# Altium schematic sheet СОЕД.SchDoc
size A2; Organization: Altium Limited; Address1: L3, 12a Rodborough Rd; Address2: Frenchs Forest; Address3: NSW; Address4: Australia 2086; SheetNumber: 1; SheetTotal: 5
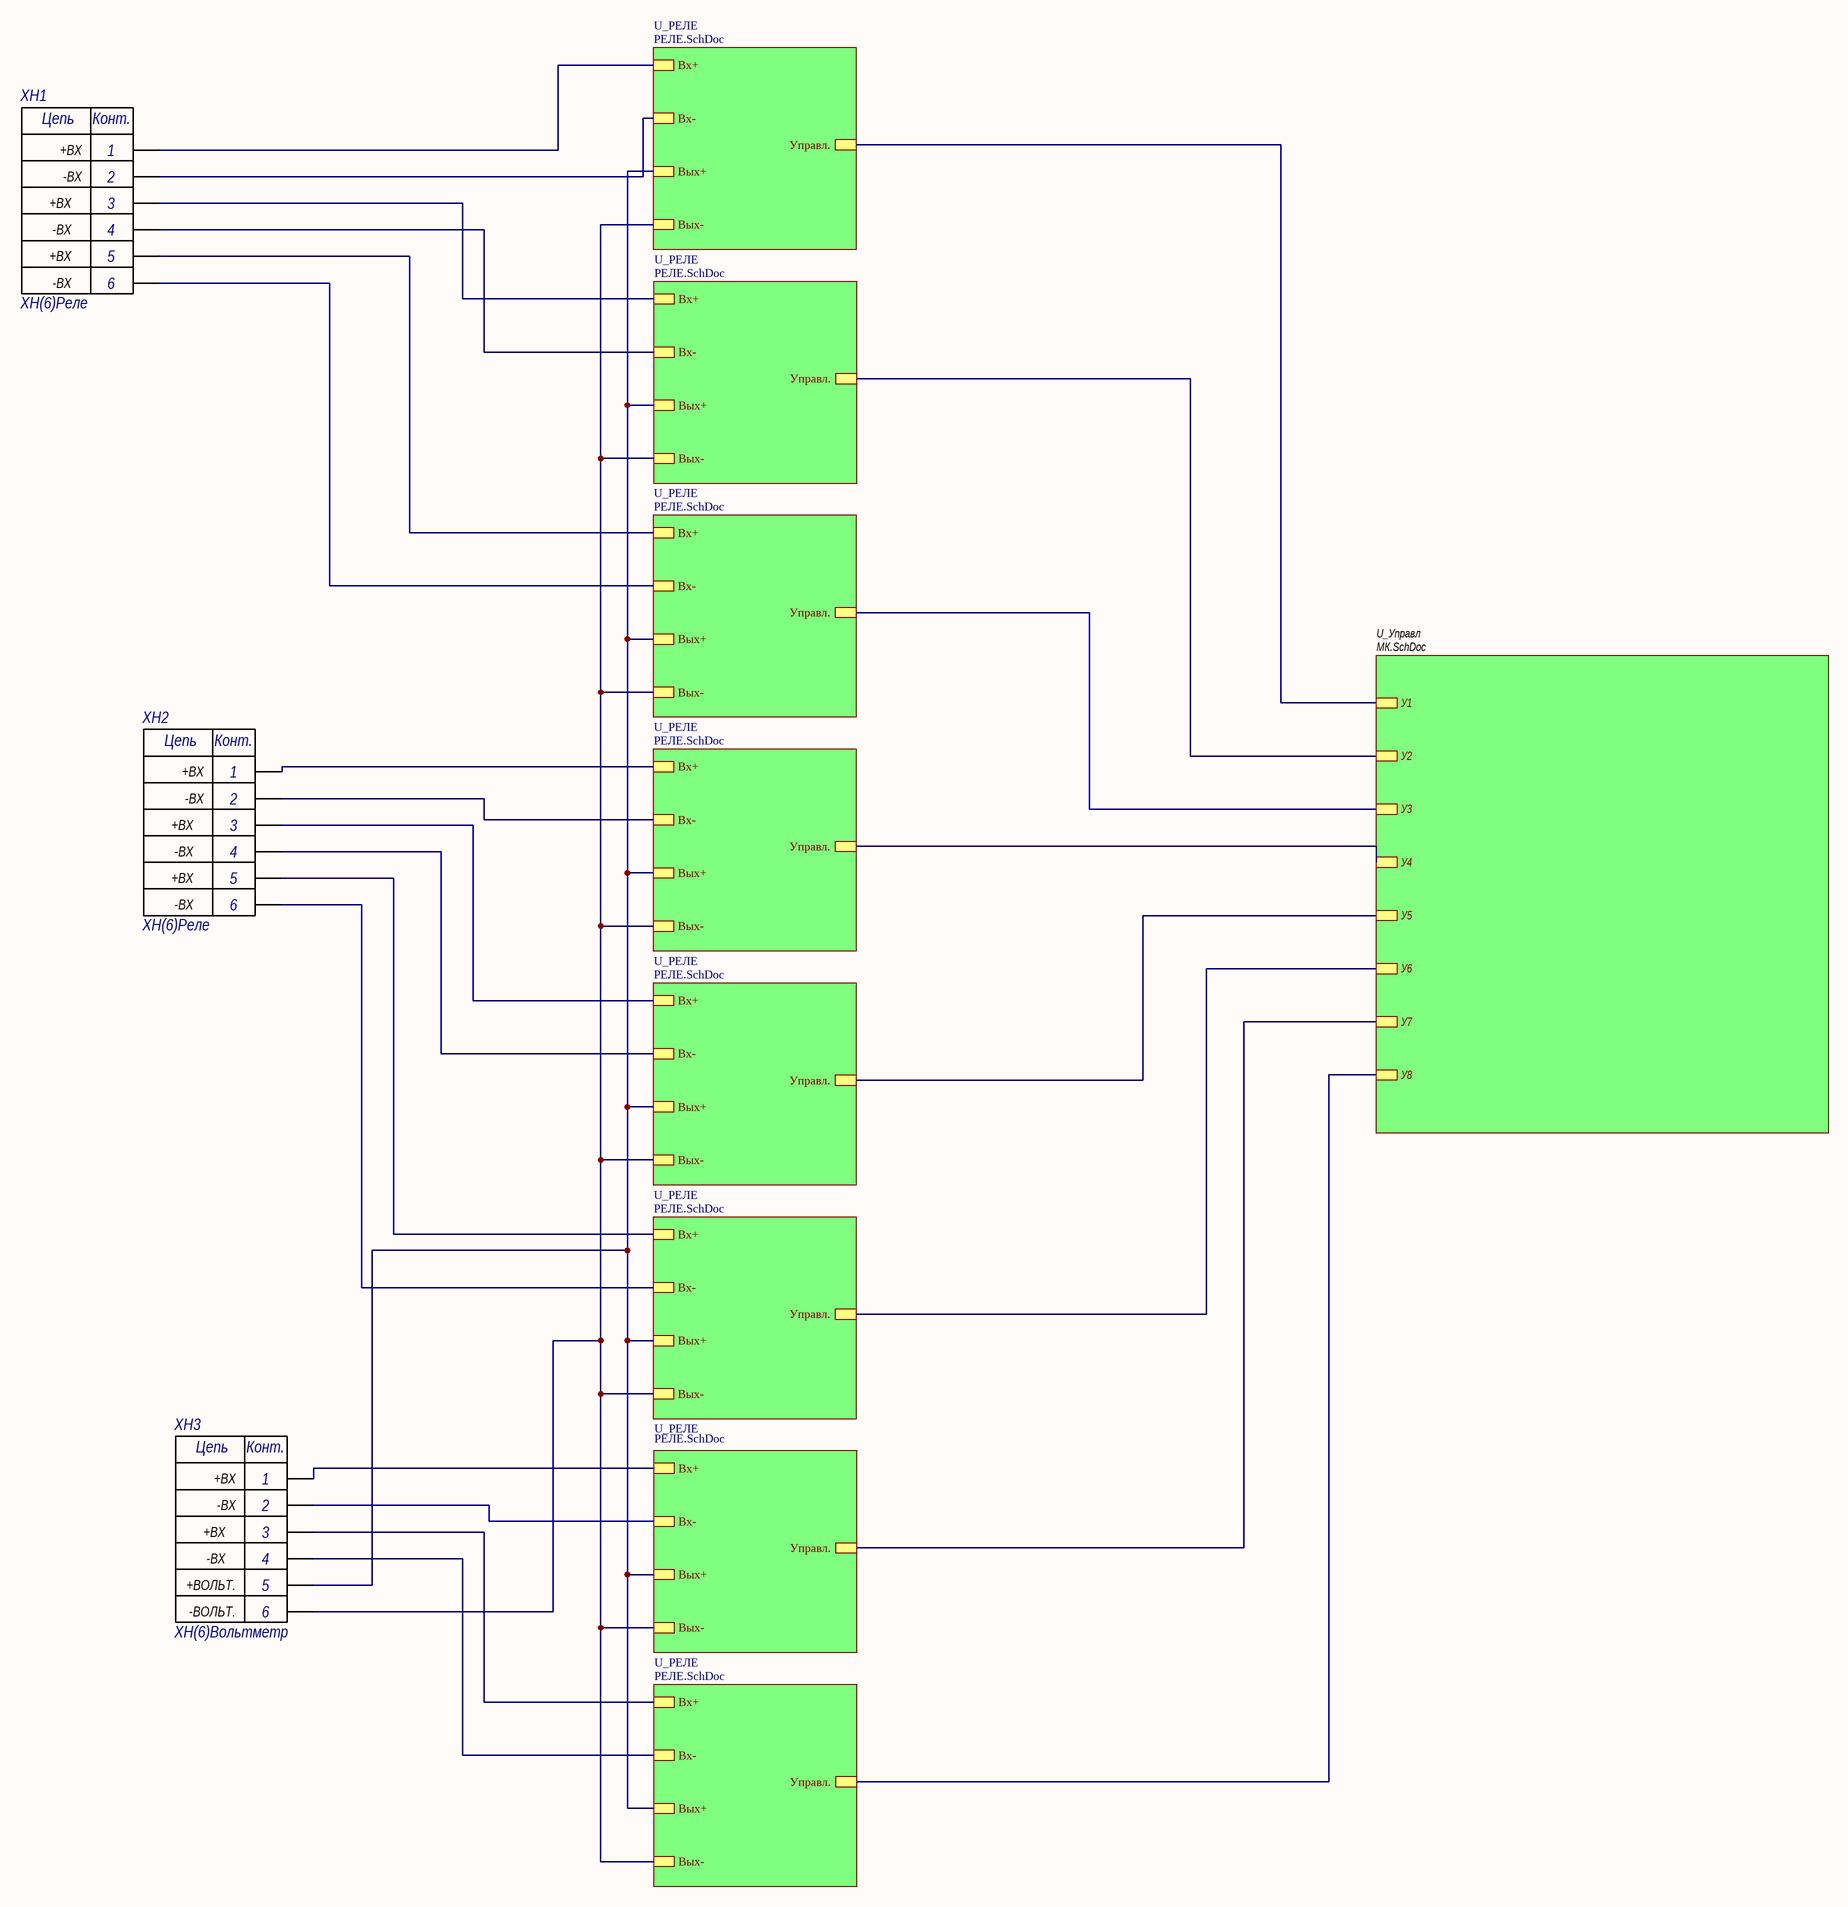
[diagram p0: СОЕД.SchDoc]

## Parts
XH1  ХH(6)Реле  [XH(6)]
XH2  ХH(6)Реле  [XH(6)]
XH3  ХH(6)Вольтметр  [XH(6)]

## Sub-sheets
U_РЕЛЕ = РЕЛЕ.SchDoc: Управл., Вх+, Вх-, Вых-, Вых+
U_РЕЛЕ = РЕЛЕ.SchDoc: Управл., Вх+, Вх-, Вых-, Вых+
U_РЕЛЕ = РЕЛЕ.SchDoc: Управл., Вх+, Вх-, Вых-, Вых+
U_РЕЛЕ = РЕЛЕ.SchDoc: Управл., Вх+, Вх-, Вых-, Вых+
U_РЕЛЕ = РЕЛЕ.SchDoc: Управл., Вх+, Вх-, Вых-, Вых+
U_РЕЛЕ = РЕЛЕ.SchDoc: Управл., Вх+, Вх-, Вых-, Вых+
U_РЕЛЕ = РЕЛЕ.SchDoc: Управл., Вх+, Вх-, Вых-, Вых+
U_РЕЛЕ = РЕЛЕ.SchDoc: Управл., Вх+, Вх-, Вых-, Вых+
U_Управл = МК.SchDoc: У8, У7, У2, У6, У5, У3, У1, У4

## Nets
NetXH1_1: XH1.1(+ВХ) ; sheet U_РЕЛЕ/Вх+
NetXH1_2: XH1.2(-ВХ) ; sheet U_РЕЛЕ/Вх-
NetXH1_3: XH1.3(+ВХ) ; sheet U_РЕЛЕ/Вх+
NetXH1_4: XH1.4(-ВХ) ; sheet U_РЕЛЕ/Вх-
NetXH1_5: XH1.5(+ВХ) ; sheet U_РЕЛЕ/Вх+
NetXH1_6: XH1.6(-ВХ) ; sheet U_РЕЛЕ/Вх-
NetXH2_1: XH2.1(+ВХ) ; sheet U_РЕЛЕ/Вх+
NetXH2_2: XH2.2(-ВХ) ; sheet U_РЕЛЕ/Вх-
NetXH2_3: XH2.3(+ВХ) ; sheet U_РЕЛЕ/Вх+
NetXH2_4: XH2.4(-ВХ) ; sheet U_РЕЛЕ/Вх-
NetXH2_5: XH2.5(+ВХ) ; sheet U_РЕЛЕ/Вх+
NetXH2_6: XH2.6(-ВХ) ; sheet U_РЕЛЕ/Вх-
NetXH3_1: XH3.1(+ВХ) ; sheet U_РЕЛЕ/Вх+
NetXH3_2: XH3.2(-ВХ) ; sheet U_РЕЛЕ/Вх-
NetXH3_3: XH3.3(+ВХ) ; sheet U_РЕЛЕ/Вх+
NetXH3_4: XH3.4(-ВХ) ; sheet U_РЕЛЕ/Вх-
NetXH3_5: XH3.5(+ВОЛЬТ.) ; sheet U_РЕЛЕ/Вых+, sheet U_РЕЛЕ/Вых+, sheet U_РЕЛЕ/Вых+, sheet U_РЕЛЕ/Вых+, sheet U_РЕЛЕ/Вых+, sheet U_РЕЛЕ/Вых+, sheet U_РЕЛЕ/Вых+, sheet U_РЕЛЕ/Вых+
NetXH3_6: XH3.6(-ВОЛЬТ.) ; sheet U_РЕЛЕ/Вых-, sheet U_РЕЛЕ/Вых-, sheet U_РЕЛЕ/Вых-, sheet U_РЕЛЕ/Вых-, sheet U_РЕЛЕ/Вых-, sheet U_РЕЛЕ/Вых-, sheet U_РЕЛЕ/Вых-, sheet U_РЕЛЕ/Вых-
(unnamed): sheet U_РЕЛЕ/Управл., sheet U_Управл/У1
(unnamed): sheet U_Управл/У8, sheet U_РЕЛЕ/Управл.
(unnamed): sheet U_Управл/У7, sheet U_РЕЛЕ/Управл.
(unnamed): sheet U_Управл/У2, sheet U_РЕЛЕ/Управл.
(unnamed): sheet U_Управл/У6, sheet U_РЕЛЕ/Управл.
(unnamed): sheet U_Управл/У5, sheet U_РЕЛЕ/Управл.
(unnamed): sheet U_Управл/У3, sheet U_РЕЛЕ/Управл.
(unnamed): sheet U_Управл/У4, sheet U_РЕЛЕ/Управл.

## Notes on the sheet
- Title
- Size:
- Date:
- File:
- A2
- Number:
- Time:
- Revision:
- Sheet
- of
- (in symbol ХH(6)Вольтметр) Цепь; Конт.
- (in symbol ХH(6)Реле) Цепь; Конт.